# EasyEDA schematic 0003.json
TITLE: Sheet_1; REV: 1.0; Date: 2020-10-06; Sheet: 1/1; Company: Your Company
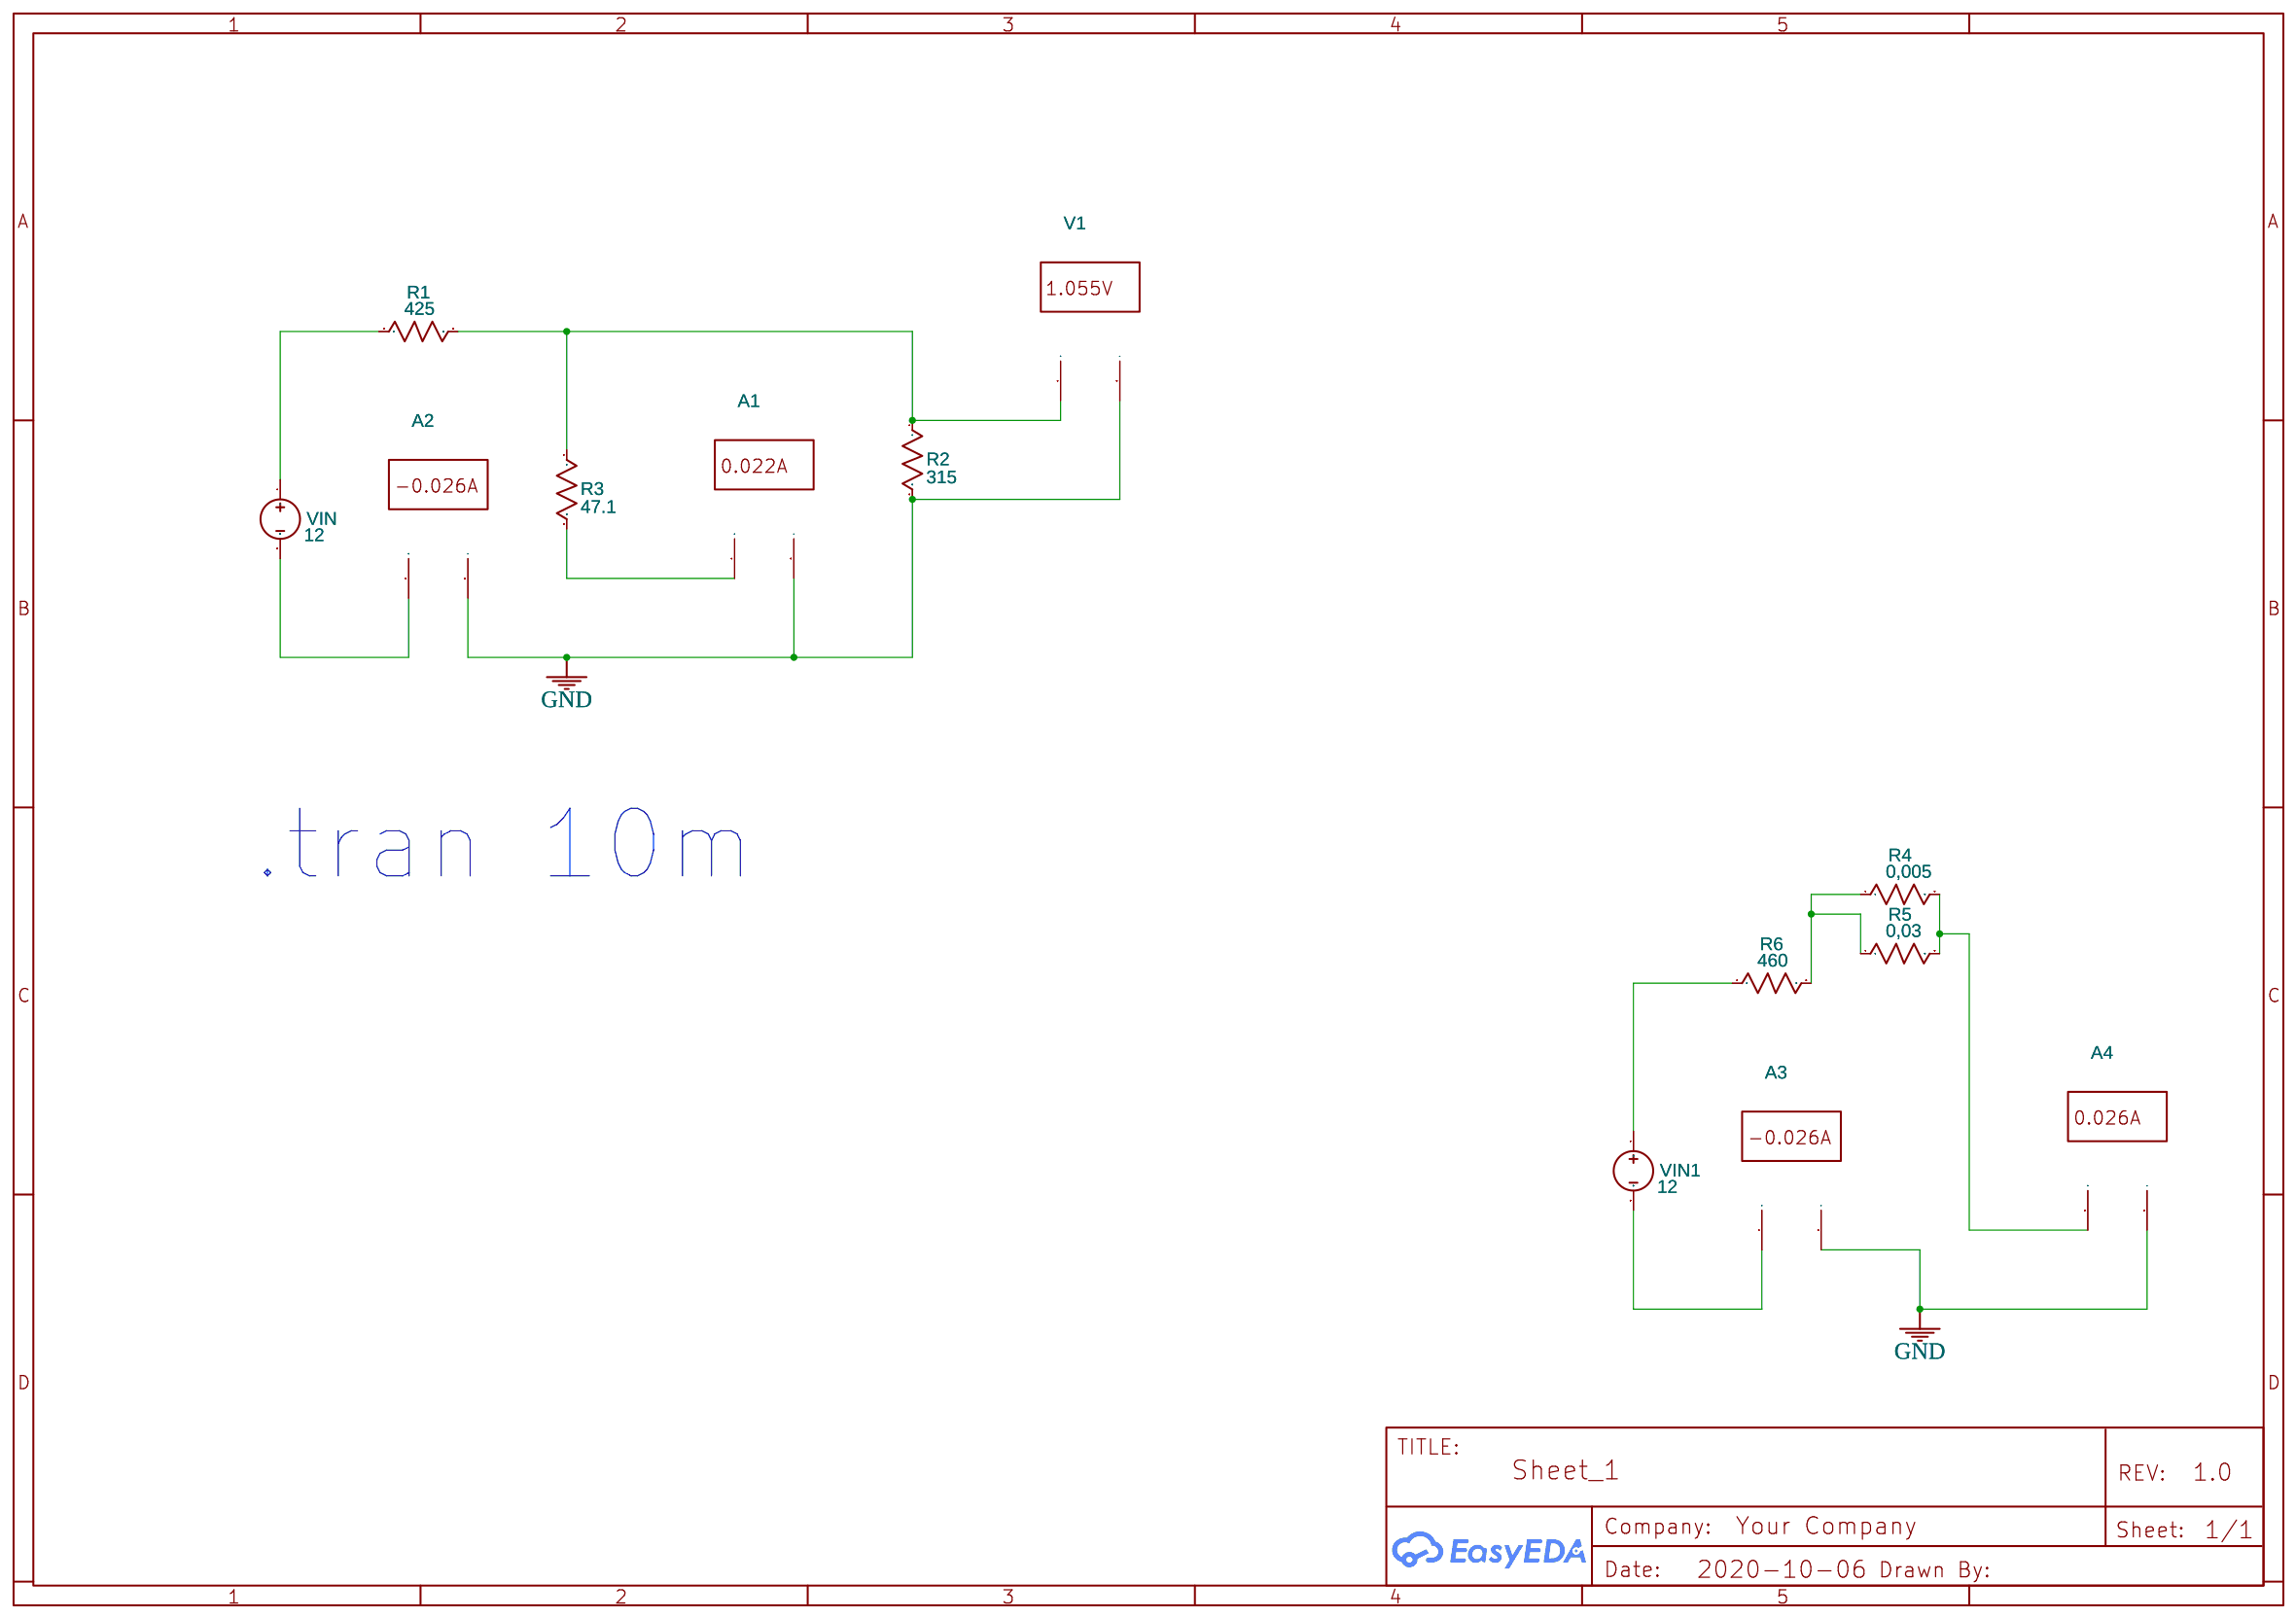
[diagram p0: schematic sheet]

## Parts
A1  Multimeter
A2  Multimeter
A3  Multimeter
A4  Multimeter
R1  425  [AXIAL-0.3]
R2  315  [AXIAL-0.3]
R3  47.1  [AXIAL-0.3]
R4  0,005  [AXIAL-0.3]
R5  0,03  [AXIAL-0.3]
R6  460  [AXIAL-0.3]
V1  Multimeter
VIN  12  [HDR1X2]
VIN1  12  [HDR1X2]

## Library data of the parts
A1-A4 = MULTIMETER: Supplier: LCSC; Multimeter Type: Amper; Power Type: AC; Voltmeter resistance: 10μ; Ammeter resistance: 1G; NameDisplay: 0; Contributor: EasyEDA; sim: true
R1-R6 = Resistor_US: Resistance: 1k; Contributor: EasyEDA; Supplier: YUJING
V1 = MULTIMETER: Supplier: LCSC; Multimeter Type: Voltmeter; Power Type: AC; Voltmeter resistance: 10μ; Ammeter resistance: 1G; NameDisplay: 0; Contributor: EasyEDA; sim: true
VIN VIN1 = VDC: Contributor: EasyEDA; sim: true

## Nets
GND: A1.2(I) A2.2(I) A3.2(I) A4.2(I) R2.2 V1.2(I)
Net-(A1-1): A1.1(+) R3.2
Net-(A2-1): A2.1(+) VIN.2
Net-(A3-1): A3.1(+) VIN1.2
Net-(A4-1): A4.1(+) R4.2 R5.2
Net-(R1-1): R1.1 VIN.1
Net-(R1-2): R1.2 R2.1 R3.1 V1.1(+)
Net-(R4-1): R4.1 R5.1 R6.2
Net-(R6-1): R6.1 VIN1.1

## Notes on the sheet
- .tran 10m
